# Altium schematic sheet microController.SchDoc
size A; SheetNumber: 2; SheetTotal: 5
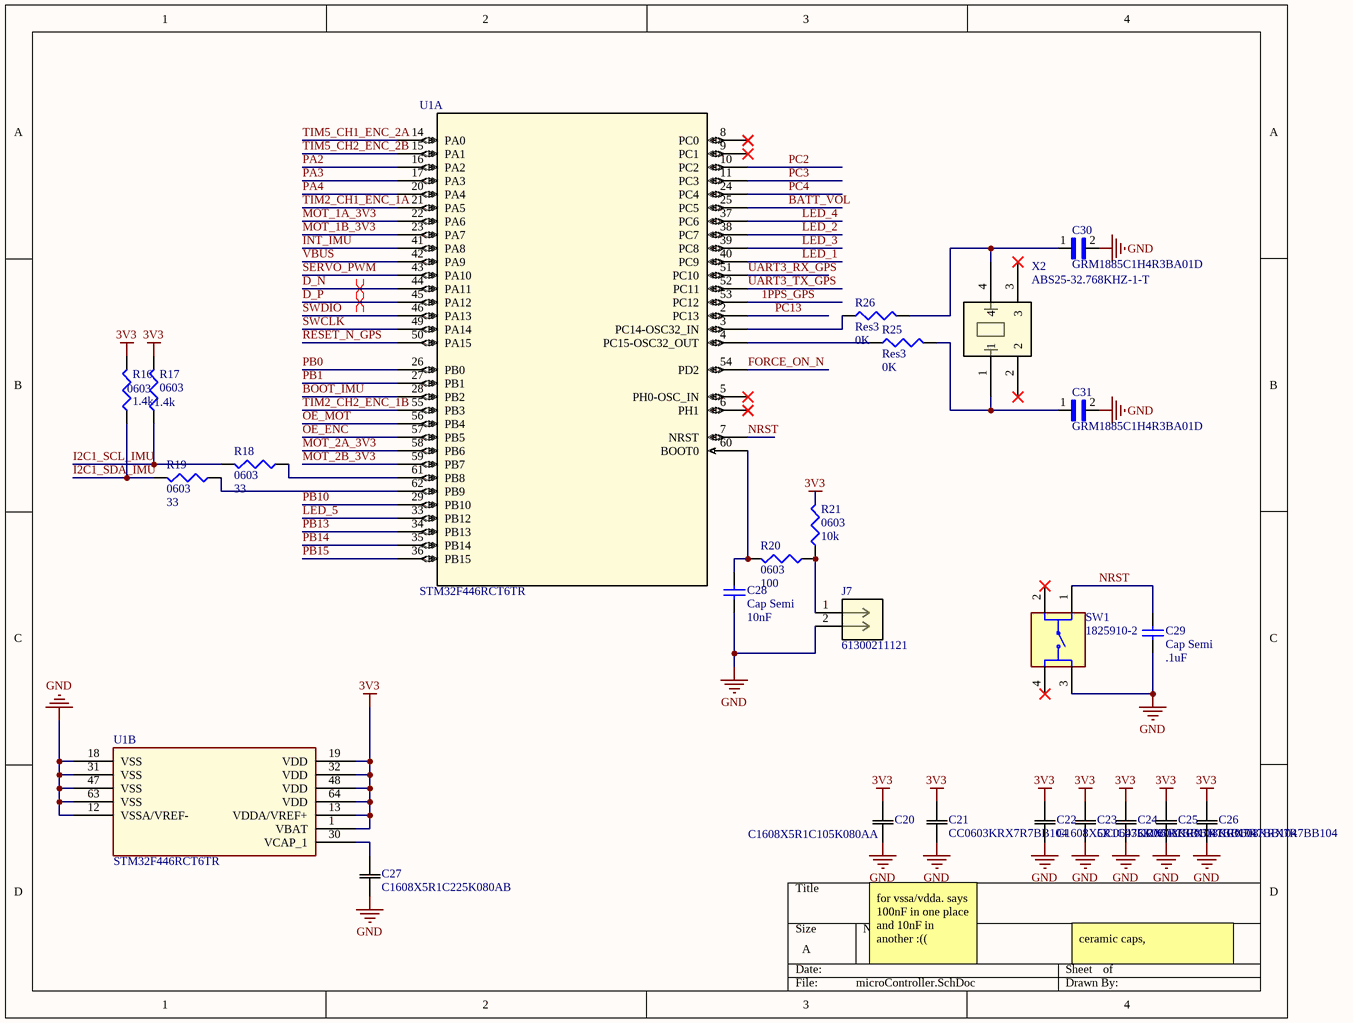
[diagram p0: microController.SchDoc]

## Parts
C20  C1608X5R1C105K080AA  [CAP_1608_TDK]
C21  CC0603KRX7R7BB104  [CC0603N_YAG]
C22  C1608X5R1C475K080AC  [CAP_1608_TDK]
C23  CC0603KRX7R7BB104  [CC0603N_YAG]
C24  CC0603KRX7R7BB104  [CC0603N_YAG]
C25  CC0603KRX7R7BB104  [CC0603N_YAG]
C26  CC0603KRX7R7BB104  [CC0603N_YAG]
C27  C1608X5R1C225K080AB  [CAP_1608_TDK]
C28  Cap Semi  value 10nF  [1608[0603]]
C29  Cap Semi  value .1uF  [1608[0603]]
C30  GRM1885C1H4R3BA01D  [CAPC1608X90N]
C31  GRM1885C1H4R3BA01D  [CAPC1608X90N]
J7  61300211121  [CONN_61300211121_WRE]
R16  0603  value 1.4k  [J1-0603]
R17  0603  value 1.4k  [J1-0603]
R18  0603  value 33  [J1-0603]
R19  0603  value 33  [J1-0603]
R20  0603  value 100  [J1-0603]
R21  0603  value 10k  [J1-0603]
R25  Res3  value 0K  [J1-0603]
R26  Res3  value 0K  [J1-0603]
SW1  1825910-2  [TE_1825910-2]
U1  STM32F446RCT6TR  [LQFP64-10x10mm]  (parts A,B of 2)
X2  ABS25-32.768KHZ-1-T  [ABS25-32.768KHZ-1-T_ABR]

## Nets
3V3: C20.2 C21.2 C22.2 C23.2 C24.2 C25.2 C26.2 R16.2 R17.2 R21.2 U1.1(VBAT) U1.13(VDDA/VREF+) U1.19(VDD) U1.32(VDD) U1.48(VDD) U1.64(VDD)
GND: C20.1 C21.1 C22.1 C23.1 C24.1 C25.1 C26.1 C27.1 C28.1 C29.1 C30.2 C31.2 J7.2 SW1.3 U1.12(VSSA/VREF-) U1.18(VSS) U1.31(VSS) U1.47(VSS) U1.63(VSS)
1PPS_GPS: U1.53(PC12)
BATT_VOL: U1.25(PC5)
BOOT_IMU: U1.28(PB2)
D_N: U1.44(PA11)
D_P: U1.45(PA12)
FORCE_ON_N: U1.54(PD2)
I2C1_SCL_IMU: R17.1 R18.2
I2C1_SDA_IMU: R16.1 R19.2
INT_IMU: U1.41(PA8)
LED_1: U1.40(PC9)
LED_2: U1.38(PC7)
LED_3: U1.39(PC8)
LED_4: U1.37(PC6)
LED_5: U1.33(PB12)
MOT_1A_3V3: U1.22(PA6)
MOT_1B_3V3: U1.23(PA7)
MOT_2A_3V3: U1.58(PB6)
MOT_2B_3V3: U1.59(PB7)
NRST: C29.2 SW1.1 U1.7(NRST)
OE_ENC: U1.57(PB5)
OE_MOT: U1.56(PB4)
PA2: U1.16(PA2)
PA3: U1.17(PA3)
PA4: U1.20(PA4)
PB0: U1.26(PB0)
PB1: U1.27(PB1)
PB10: U1.29(PB10)
PB13: U1.34(PB13)
PB14: U1.35(PB14)
PB15: U1.36(PB15)
PC2: U1.10(PC2)
PC3: U1.11(PC3)
PC4: U1.24(PC4)
PC13: U1.2(PC13)
RESET_N_GPS: U1.50(PA15)
SERVO_PWM: U1.43(PA10)
SWCLK: U1.49(PA14)
SWDIO: U1.46(PA13)
TIM2_CH1_ENC_1A: U1.21(PA5)
TIM2_CH2_ENC_1B: U1.55(PB3)
TIM5_CH1_ENC_2A: U1.14(PA0)
TIM5_CH2_ENC_2B: U1.15(PA1)
UART3_RX_GPS: U1.51(PC10)
UART3_TX_GPS: U1.52(PC11)
VBUS: U1.42(PA9)
NetC27_2: C27.2 U1.30(VCAP_1)
NetC28_2: C28.2 R20.2 U1.60(BOOT0)
NetC30_1: C30.1 R26.2 X2.4
NetC31_1: C31.1 R25.2 X2.1
NetJ7_1: J7.1 R20.1 R21.1
NetR18_1: R18.1 U1.61(PB8)
NetR19_1: R19.1 U1.62(PB9)
NetR25_1: R25.1 U1.4(PC15-OSC32_OUT)
NetR26_1: R26.1 U1.3(PC14-OSC32_IN)

Not connected (* = marked no-connect by the designer): SW1 2* 4*; U1 5(PH0-OSC_IN)* 6(PH1)* 8(PC0)* 9(PC1)*; X2 2* 3*

## Layout directives
differential pair: D_N, D_P

## Notes on the sheet
- for vssa/vdda. says 100nF in one place and 10nF in another :((
- ceramic caps,

## Library data of the parts
C20 = C1608X5R1C105K080AA: No Description Available; Mfr_Name: TDK; Type: DEV; Copyright: Copyright (C) 2023 Ultra Librarian. All rights reserved.; Manufacturer_Part_Number: C1608X5R1C105K080AA; Digi-Key_Part_Number_1: 445-1416-1-ND; Digi-Key_Part_Number_2: 445-1416-2-ND; Digi-Key_Part_Number_3: 445-1416-6-ND; RefDes: RefDes
C21 C23-C26 = CC0603KRX7R7BB104: No Description Available; Mfr_Name: Yageo; Type: DEV; Copyright: Copyright (C) 2023 Ultra Librarian. All rights reserved.; Manufacturer_Part_Number: CC0603KRX7R7BB104; Digi-Key_Part_Number_1: 311-1088-1-ND; Digi-Key_Part_Number_2: 311-1088-2-ND; Digi-Key_Part_Number_3: 311-1088-2-NDL; Digi-Key_Part_Number_4: 311-1088-6-ND; RefDes: RefDes
C22 = C1608X5R1C475K080AC: No Description Available; Mfr_Name: TDK; Type: DEV; Copyright: Copyright (C) 2023 Ultra Librarian. All rights reserved.; Manufacturer_Part_Number: C1608X5R1C475K080AC; Digi-Key_Part_Number_1: 445-7478-1-ND; Digi-Key_Part_Number_2: 445-7478-2-ND; Digi-Key_Part_Number_3: 445-7478-6-ND; RefDes: RefDes
C27 = C1608X5R1C225K080AB: No Description Available; Mfr_Name: TDK; Type: DEV; Copyright: Copyright (C) 2023 Ultra Librarian. All rights reserved.; Manufacturer_Part_Number: C1608X5R1C225K080AB; Digi-Key_Part_Number_1: 445-5157-1-ND; Digi-Key_Part_Number_2: 445-5157-2-ND; Digi-Key_Part_Number_3: 445-5157-6-ND; RefDes: RefDes
C28 C29 = Cap Semi: Capacitor (Semiconductor SIM Model); Published: 8-Jun-2000; LatestRevisionDate: 29-May-2009; LatestRevisionNote: IPC-7351 Footprint Added.; PackageReference: C1206; Publisher: Altium Limited; PackageDescription: Chip Capacitor
C30 C31 = GRM1885C1H4R3BA01D: SMD Capacitor C0G(EIA) with Capacitance: 4.3pF Tol. 0.1pF. Rated Voltage: 50Vdc; MF: Murata; MP: GRM1885C1H4R3BA01D; Value: *; Package: 1608 Murata; Price: None; Check_prices: https://www.snapeda.com/parts/GRM1885C1H4R3BA01D/Murata%20Electronics%20North%20America/view-part/1775789/?ref=eda; SnapEDA_Link: https://www.snapeda.com/parts/GRM1885C1H4R3BA01D/Murata%20Electronics%20North%20America/view-part/1775789/?ref=snap; Availability: Unavailable
J7 = 61300211121: No Description Available; Mfr_Name: Wurth Electronics; Copyright: Copyright (C) 2023 Ultra Librarian. All rights reserved.; Manufacturer_Part_Number: 61300211121; RefDes: RefDes; Type: DEV
R16-R21 R25 R26 = Res3: Resistor; Published: 8-Jun-2000; LatestRevisionDate: 29-May-2009; LatestRevisionNote: IPC-7351 Footprint Added.; PackageReference: J1-0603; Publisher: Altium Limited; PackageDescription: Chip Resistor
SW1 = 1825910-2: 50 mA SPST Round Actuator 160 Gram Force Tactile Pushbutton Switch; MF: TE Connectivity; Check_prices: https://www.snapeda.com/parts/1825910-2/TE+Connectivity+ALCOSWITCH+Switches/view-part/?ref=eda; Value: *; Availability: In Stock; MP: 1825910-2; Price: None; Package: None; SnapEDA_Link: https://www.snapeda.com/parts/1825910-2/TE+Connectivity+ALCOSWITCH+Switches/view-part/?ref=snap; Purchase-URL: https://pricing.snapeda.com/search/part/1825910-2/?ref=eda; EU_RoHS_Compliance: Compliant
U1 = STM32F446RCT6TR: No Description Available; Mfr_Name: STMicroelectronics; Copyright: Copyright (C) 2023 Ultra Librarian. All rights reserved.; Manufacturer_Part_Number: STM32F446RCT6TR; Digi-Key_Part_Number_1: 497-19357-2-ND; Digi-Key_Part_Number_2: 497-19357-1-ND; Digi-Key_Part_Number_3: 497-19357-6-ND; RefDes: RefDes; Type: DEV
X2 = ABS25-32.768KHZ-1-T: No Description Available; Mfr_Name: Abracon; Copyright: Copyright (C) 2023 Ultra Librarian. All rights reserved.; Manufacturer_Part_Number: ABS25-32.768KHZ-1-T; RefDes: RefDes; Type: DEV